# Altium schematic sheet LED.SchDoc
size A4
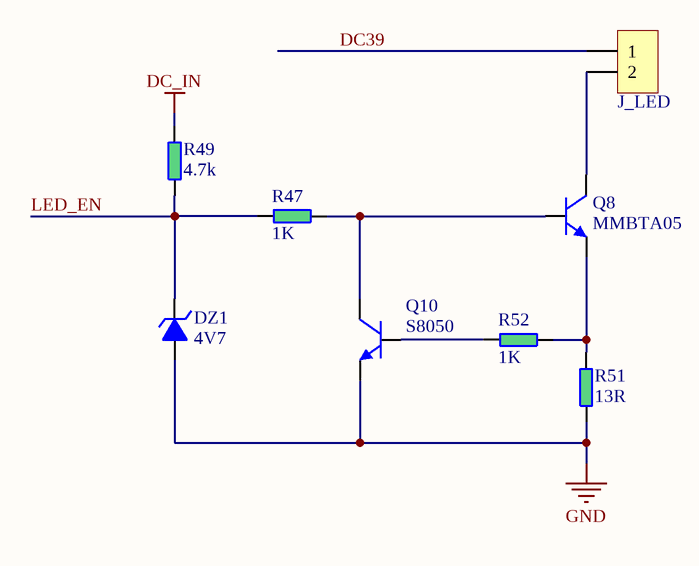
[diagram p0: LED.SchDoc]

## Parts
DZ1  4V7  [D ZMM4V7-LL34]
J_LED  Pin02  [XH2.54 2P]  (value not drawn)
Q8  MMBTA05  [BJT-MMBTA05/60V/0.5A-SOT23]
Q10  S8050  [BJT-S8050-SOT23]
R47  1K  [R 0805]
R49  4.7k  [R 0603]
R51  13R  [R 0805]
R52  1K  [R 0603]

## Nets
DC_IN: R49.2
GND: DZ1.A Q10.E R51.1
DC39: J_LED.1
LED_EN: DZ1.K R47.1 R49.1
NetJ_LED_2: J_LED.2 Q8.C
NetQ8_B: Q8.B Q10.C R47.2
NetQ8_E: Q8.E R51.2 R52.2
NetQ10_B: Q10.B R52.1

## Library data of the parts
DZ1 = 13.Diode - Zen: 稳压管
Q8 Q10 = 07.BJT(N): 三极管 NPN
R47 R49 R51 R52 = 01.Res: 电阻